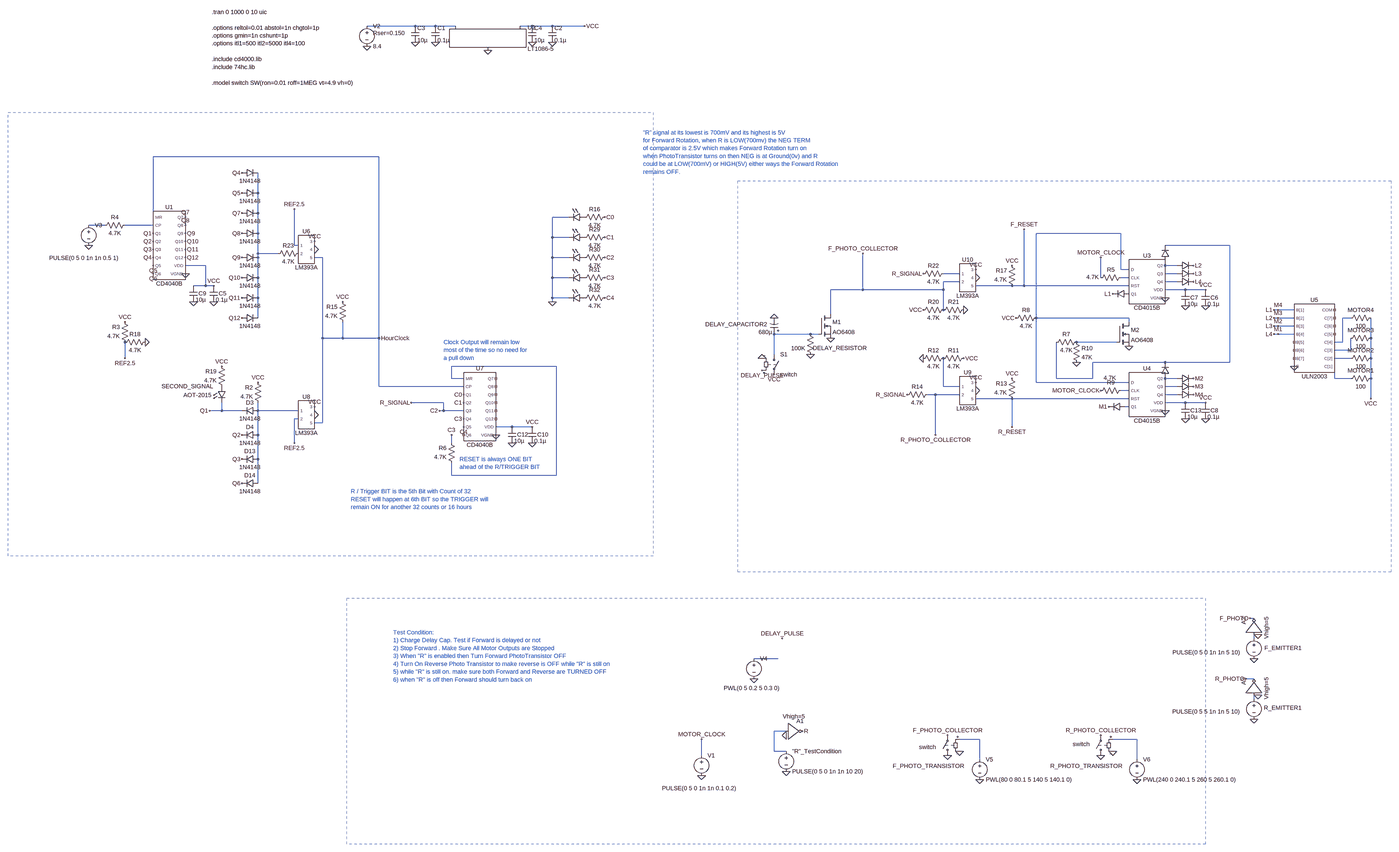
[diagram p0: schematic Draft4_CD4060_LM393.asc, whole sheet]
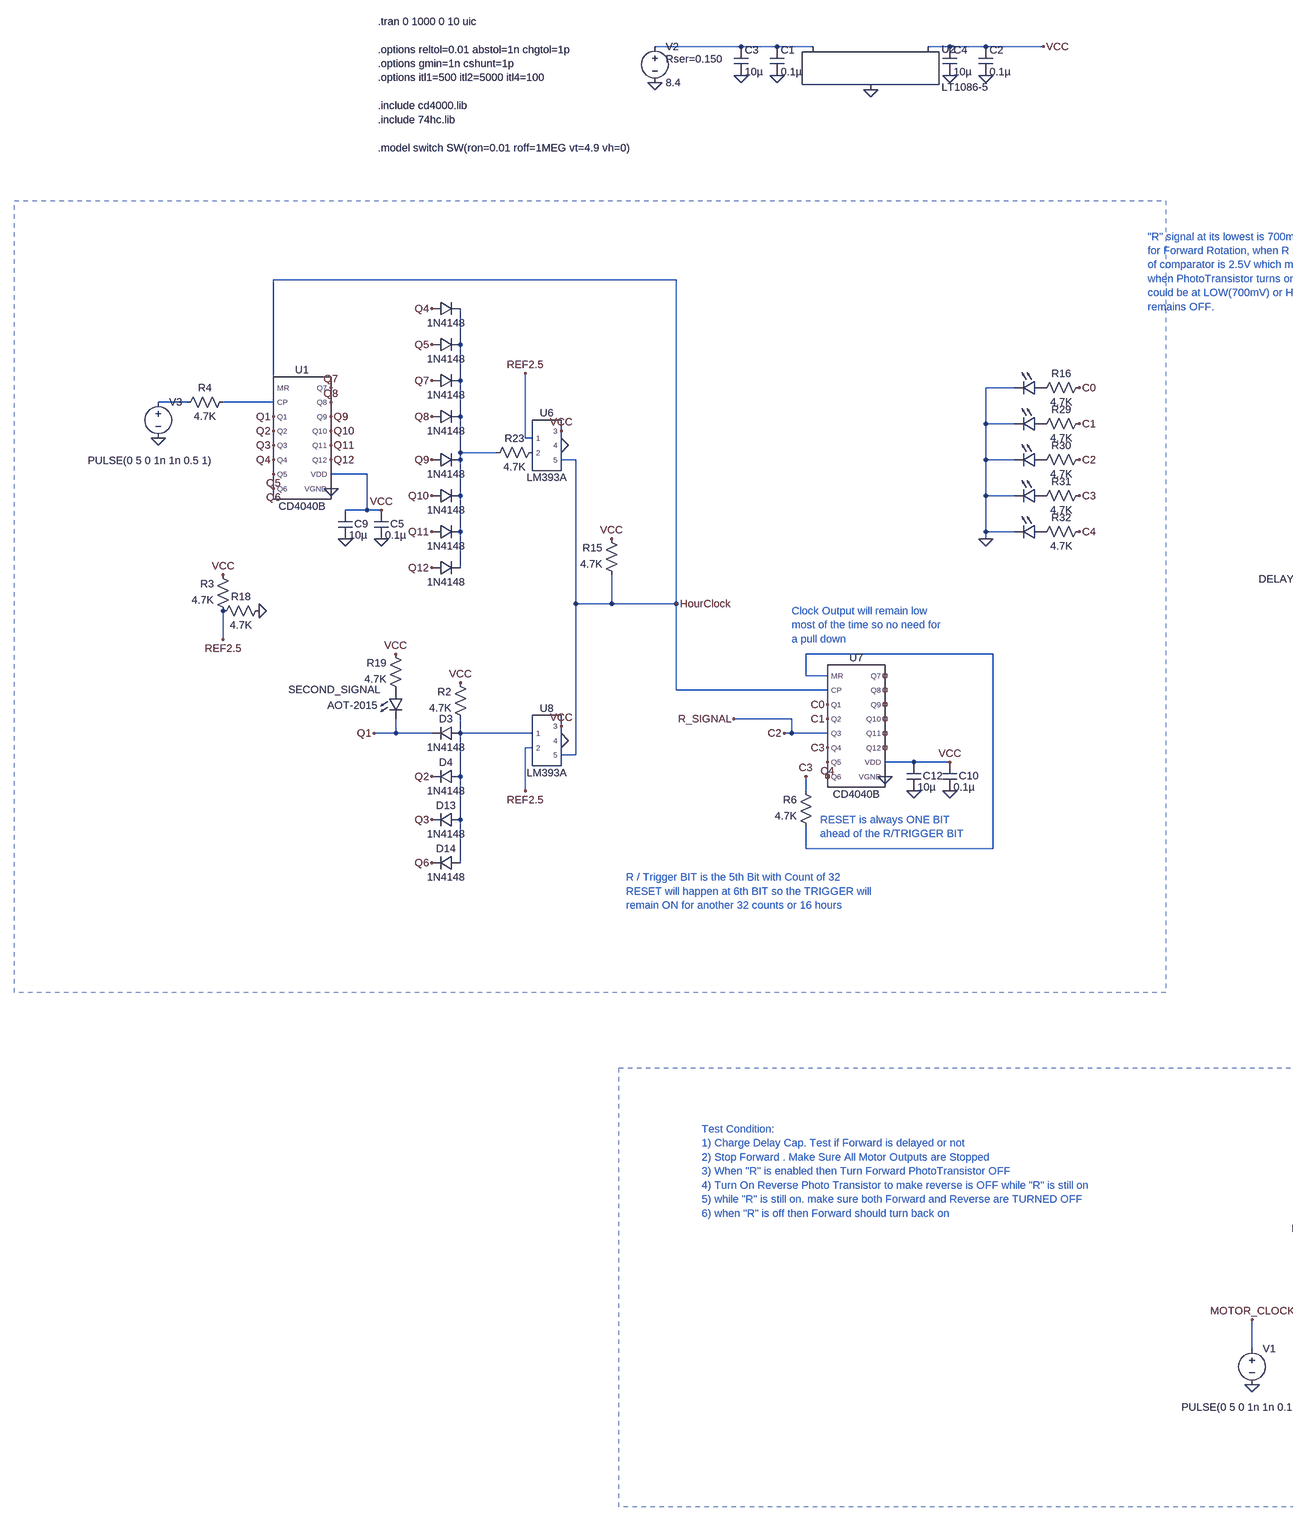
[diagram p1: schematic Draft4_CD4060_LM393.asc, part, row 1 of 1, column 1 of 2]
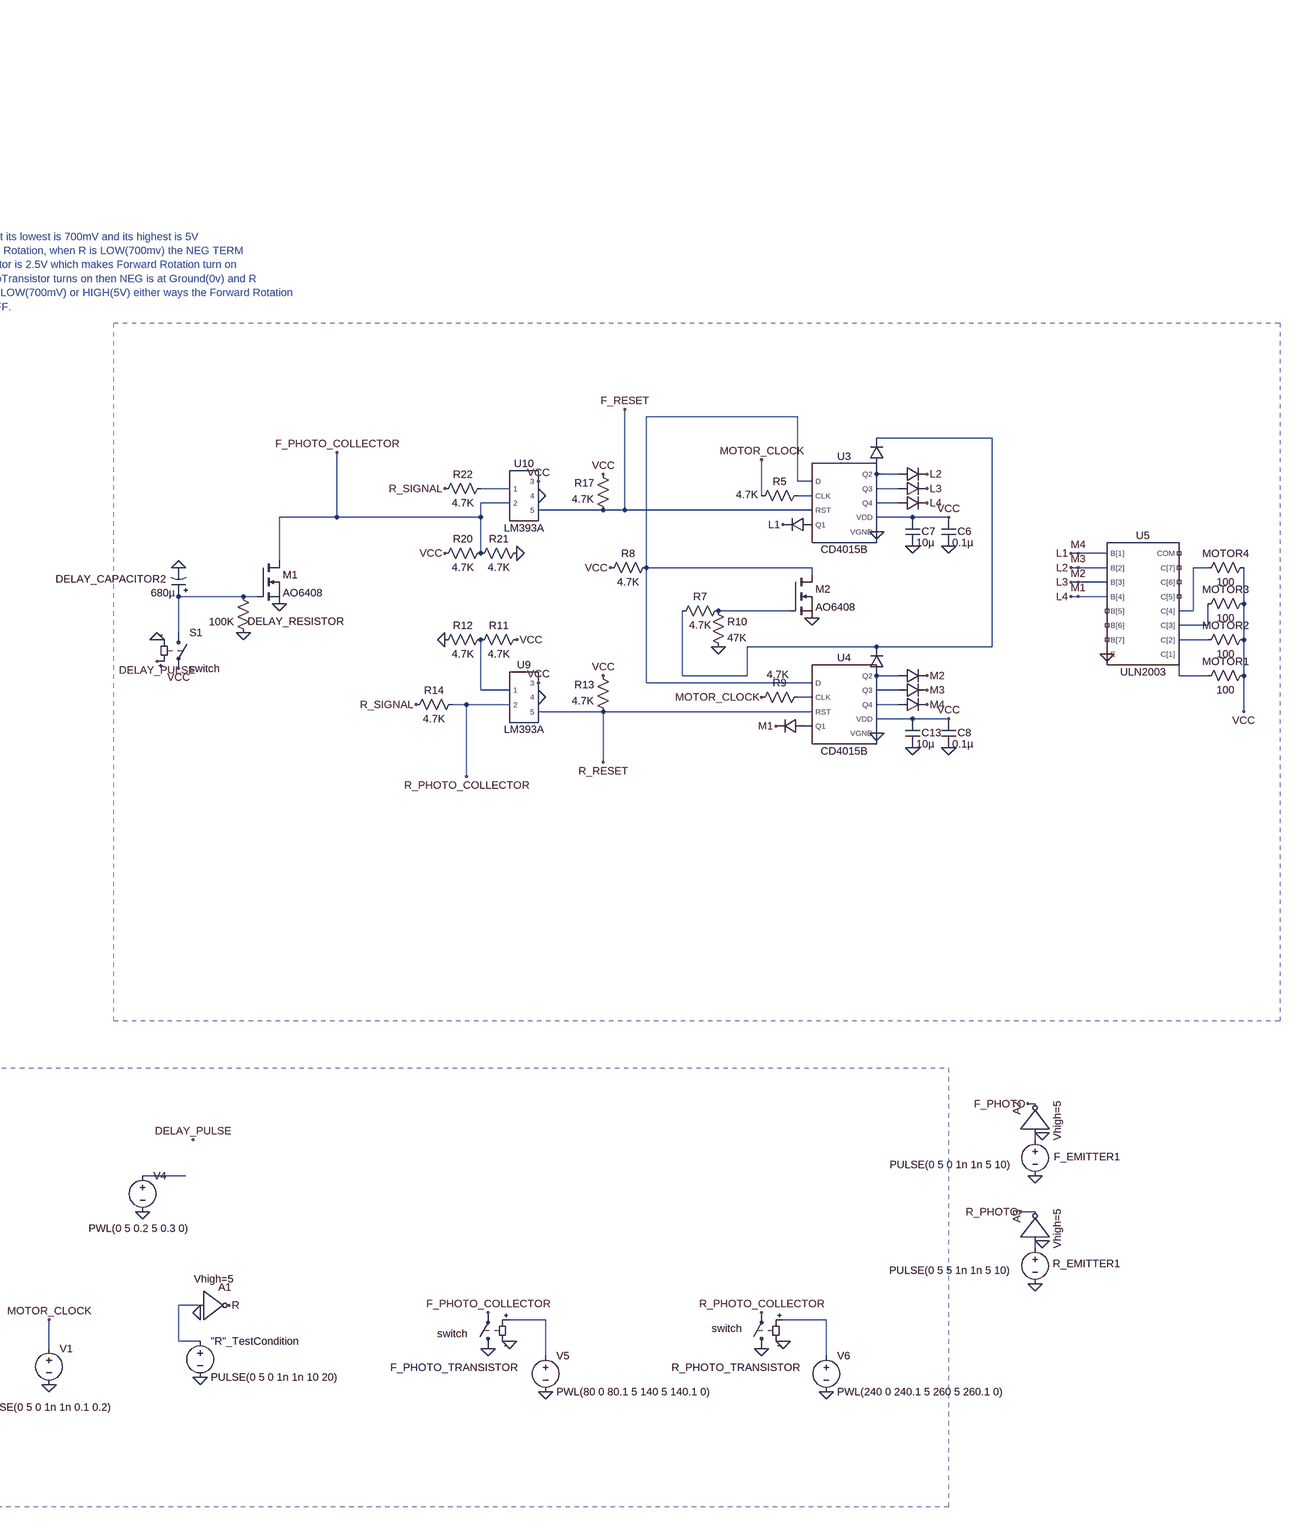
[diagram p2: schematic Draft4_CD4060_LM393.asc, part, row 1 of 1, column 2 of 2]
Draft4_CD4060_LM393.asc, the LTspice schematic file:
Version 4
SHEET 1 3252 2292
WIRE -1248 -1328 -1440 -1328
WIRE -1168 -1328 -1248 -1328
WIRE -1088 -1328 -1168 -1328
WIRE -784 -1328 -832 -1328
WIRE -704 -1328 -784 -1328
WIRE -576 -1328 -704 -1328
WIRE -1392 -448 -2288 -448
WIRE -1872 -304 -1872 -384
WIRE -1872 -224 -1872 -304
WIRE -2288 -208 -2288 -448
WIRE -640 -208 -704 -208
WIRE -2480 -176 -2544 -176
WIRE -2288 -176 -2400 -176
WIRE -1872 -144 -1872 -224
WIRE 1552 -144 1216 -144
WIRE -704 -128 -704 -208
WIRE -640 -128 -704 -128
WIRE -1728 -96 -1728 -240
WIRE -1712 -96 -1728 -96
WIRE 1984 -96 1728 -96
WIRE -1872 -64 -1872 -144
WIRE -1792 -64 -1872 -64
WIRE -1872 -48 -1872 -64
WIRE -1616 -48 -1648 -48
WIRE -704 -48 -704 -128
WIRE -640 -48 -704 -48
WIRE -2080 -16 -2160 -16
WIRE 1728 -16 1728 -32
WIRE 1776 -16 1728 -16
WIRE 1552 0 1552 -144
WIRE 1584 0 1552 0
WIRE 912 16 848 16
WIRE 1776 16 1728 16
WIRE -1872 32 -1872 -48
WIRE -704 32 -704 -48
WIRE -640 32 -704 32
WIRE 1472 32 1472 -48
WIRE 1584 32 1552 32
WIRE 912 48 848 48
WIRE 1776 48 1728 48
WIRE -2080 64 -2080 -16
WIRE -2080 64 -2128 64
WIRE -2048 64 -2080 64
WIRE 1120 64 976 64
WIRE 1168 64 1168 -160
WIRE 1168 64 1120 64
WIRE 1584 64 1168 64
WIRE 528 80 528 -64
WIRE 528 80 400 80
WIRE 848 80 848 48
WIRE 848 80 528 80
WIRE 1808 80 1728 80
WIRE 1888 80 1808 80
WIRE -1872 112 -1872 32
WIRE -704 112 -704 32
WIRE -640 112 -704 112
WIRE -704 128 -704 112
WIRE 848 160 848 80
WIRE 2176 160 2160 160
WIRE 2240 160 2176 160
WIRE 400 176 400 80
WIRE -1872 192 -1872 112
WIRE 1216 192 1216 -144
WIRE 1584 192 1216 192
WIRE 2176 192 2160 192
WIRE 2240 192 2176 192
WIRE 2464 192 2432 192
WIRE 1584 208 1584 192
WIRE 2176 224 2160 224
WIRE 2240 224 2176 224
WIRE 320 256 176 256
WIRE 352 256 320 256
WIRE 2176 256 2160 256
WIRE 2240 256 2176 256
WIRE -1616 272 -1616 -48
WIRE -1536 272 -1536 208
WIRE -1536 272 -1616 272
WIRE -1392 272 -1392 -448
WIRE -1392 272 -1536 272
WIRE 2544 272 2544 192
WIRE 1536 288 1376 288
WIRE 2432 288 2432 192
WIRE 2432 288 2400 288
WIRE 2464 320 2464 272
WIRE 2464 320 2400 320
WIRE 176 336 176 256
WIRE -2400 352 -2400 288
WIRE 2464 352 2400 352
WIRE 2544 352 2544 272
WIRE 1728 368 1440 368
WIRE 1984 368 1984 -96
WIRE 1984 368 1728 368
WIRE -688 384 -1104 384
WIRE -1104 432 -1104 384
WIRE -1056 432 -1104 432
WIRE 1296 432 1296 288
WIRE 1440 432 1440 368
WIRE 1440 432 1296 432
WIRE 1776 432 1728 432
WIRE 2400 432 2400 384
WIRE 2464 432 2400 432
WIRE 2544 432 2544 352
WIRE 1216 448 1216 192
WIRE 1584 448 1216 448
WIRE -1392 464 -1392 272
WIRE -1056 464 -1392 464
WIRE 848 464 848 352
WIRE 912 464 848 464
WIRE 1776 464 1728 464
WIRE 1584 480 1552 480
WIRE 816 496 784 496
WIRE 912 496 816 496
WIRE 1776 496 1728 496
WIRE 1120 512 976 512
WIRE 1584 512 1120 512
WIRE 2544 512 2544 432
WIRE -1136 528 -1264 528
WIRE 1808 528 1728 528
WIRE 1888 528 1808 528
WIRE 1584 544 1568 544
WIRE -2016 560 -2016 528
WIRE -2016 560 -2064 560
WIRE -1936 560 -2016 560
WIRE -1872 560 -1872 528
WIRE -1712 560 -1872 560
WIRE -1136 560 -1136 528
WIRE -1136 560 -1152 560
WIRE -1056 560 -1136 560
WIRE -1712 592 -1728 592
WIRE -1616 608 -1616 272
WIRE -1616 608 -1648 608
WIRE -864 624 -928 624
WIRE -784 624 -864 624
WIRE 1120 624 1120 512
WIRE -1872 656 -1872 560
WIRE 816 656 816 496
WIRE -1728 688 -1728 592
WIRE -1104 688 -1104 656
WIRE -1872 752 -1872 656
WIRE -1104 816 -1104 768
WIRE -688 816 -688 384
WIRE -688 816 -1104 816
WIRE -1872 848 -1872 752
WIRE 2080 1392 2064 1392
WIRE 2080 1472 2080 1456
WIRE 192 1552 96 1552
WIRE 2080 1632 2048 1632
WIRE 2080 1712 2080 1696
WIRE 224 1840 176 1840
WIRE 992 1872 912 1872
WIRE 1616 1872 1520 1872
WIRE 176 1920 176 1840
WIRE 224 1920 176 1920
WIRE -112 1936 -112 1872
WIRE 992 1952 992 1872
WIRE 1616 1952 1616 1872
FLAG -1248 -1264 0
FLAG -1168 -1264 0
FLAG -960 -1232 0
FLAG -784 -1264 0
FLAG -704 -1264 0
FLAG -1440 -1248 0
FLAG -576 -1328 VCC
FLAG -2160 16 0
FLAG -1936 -384 Q4
FLAG -1936 -304 Q5
FLAG -2288 -144 Q1
FLAG -2288 -112 Q2
FLAG -2288 -80 Q3
FLAG -2288 -48 Q4
FLAG -2288 -16 Q5
FLAG -2288 16 Q6
FLAG -2160 -208 Q7
FLAG -2160 -176 Q8
FLAG -2160 -144 Q9
FLAG -2160 -112 Q10
FLAG -2160 -80 Q11
FLAG -2160 -48 Q12
FLAG 864 1936 0
FLAG 2080 1792 0
FLAG 1472 1936 0
FLAG 2080 1552 0
FLAG -2064 560 Q1
FLAG -1936 656 Q2
FLAG -1936 752 Q3
FLAG -1936 848 Q6
FLAG -1936 -224 Q7
FLAG -1936 -144 Q8
FLAG -1936 -48 Q9
FLAG -1936 32 Q10
FLAG -1936 112 Q11
FLAG -1936 192 Q12
FLAG 1520 1920 0
FLAG 912 1920 0
FLAG -2544 -96 0
FLAG -2400 208 VCC
FLAG -1872 448 VCC
FLAG -2048 64 VCC
FLAG -2128 128 0
FLAG -2048 128 0
FLAG -864 688 0
FLAG -784 688 0
FLAG -928 656 0
FLAG -2016 384 VCC
FLAG -1056 496 C0
FLAG -1056 528 C1
FLAG -1056 592 C3
FLAG -1056 624 C4
FLAG -784 624 VCC
FLAG 1808 144 0
FLAG 1888 144 0
FLAG 1888 80 VCC
FLAG 1728 112 0
FLAG 1472 -48 MOTOR_CLOCK
FLAG 1840 -16 L2
FLAG 1520 96 L1
FLAG 1840 48 L4
FLAG 1584 304 0
FLAG 1136 192 VCC
FLAG 1808 592 0
FLAG 1888 592 0
FLAG 1888 528 VCC
FLAG 1728 560 0
FLAG 1472 480 MOTOR_CLOCK
FLAG 1840 432 M2
FLAG 1504 544 M1
FLAG 1840 464 M3
FLAG 1840 496 M4
FLAG 1840 16 L3
FLAG 2240 384 0
FLAG -112 2016 0
FLAG -112 1872 MOTOR_CLOCK
FLAG 2544 512 VCC
FLAG 1376 368 0
FLAG 2160 160 L1
FLAG 2160 192 L2
FLAG 2160 224 L3
FLAG 2160 256 L4
FLAG 2176 160 M4
FLAG 2176 192 M3
FLAG 2176 224 M2
FLAG 2176 256 M1
FLAG 224 2000 0
FLAG 288 1840 R
FLAG 2048 1632 R_PHOTO
FLAG 2064 1392 F_PHOTO
FLAG 224 1856 0
FLAG 2096 1456 0
FLAG 864 1856 F_PHOTO_COLLECTOR
FLAG 1472 1856 R_PHOTO_COLLECTOR
FLAG 2096 1696 0
FLAG -1152 560 C2
FLAG -2320 288 0
FLAG -1648 -112 VCC
FLAG -1648 -80 0
FLAG -1648 544 VCC
FLAG -1648 576 0
FLAG -1536 128 VCC
FLAG -1392 272 HourClock
FLAG -496 -208 C0
FLAG -496 -128 C1
FLAG -496 -48 C2
FLAG -496 32 C3
FLAG -496 112 C4
FLAG -1104 656 C3
FLAG 976 448 VCC
FLAG 976 480 0
FLAG 928 352 VCC
FLAG 768 352 0
FLAG 704 496 R_SIGNAL
FLAG 1120 432 VCC
FLAG 816 656 R_PHOTO_COLLECTOR
FLAG 1120 624 R_RESET
FLAG 1120 -16 VCC
FLAG 976 0 VCC
FLAG 976 32 0
FLAG 768 160 VCC
FLAG 928 160 0
FLAG 768 16 R_SIGNAL
FLAG 528 -64 F_PHOTO_COLLECTOR
FLAG 1168 -160 F_RESET
FLAG 96 1632 0
FLAG 400 272 0
FLAG 176 416 VCC
FLAG 176 192 0
FLAG 128 352 0
FLAG 208 1472 DELAY_PULSE
FLAG 128 400 DELAY_PULSE
FLAG 320 336 0
FLAG -2400 352 REF2.5
FLAG -1728 -240 REF2.5
FLAG -1728 688 REF2.5
FLAG 992 2032 0
FLAG 1616 2032 0
FLAG -1264 528 R_SIGNAL
FLAG -704 128 0
SYMBOL CD4040B -2224 -96 R0
WINDOW 39 0 160 Invisible 2
SYMATTR InstName U1
SYMATTR Value2 vdd=5 speed=1 tripdt=5n
SYMBOL PowerProducts\\LT1086-5 -960 -1328 R0
SYMATTR InstName U2
SYMBOL cap -1184 -1328 R0
SYMATTR InstName C1
SYMATTR Value 0.1µ
SYMATTR SpiceLine V=25 Irms=0 Rser=0.025 Lser=800p mfg="Würth Elektronik" pn="885012206071 WCAP-CSGP 0603" type="X7R"
SYMBOL cap -1264 -1328 R0
SYMATTR InstName C3
SYMATTR Value 10µ
SYMATTR SpiceLine V=25 Irms=0 Rser=0 Lser=0 mfg="Murata" pn="GRM21BR61E106KA73" type="X5R"
SYMBOL cap -720 -1328 R0
SYMATTR InstName C2
SYMATTR Value 0.1µ
SYMATTR SpiceLine V=25 Irms=0 Rser=0.025 Lser=800p mfg="Würth Elektronik" pn="885012206071 WCAP-CSGP 0603" type="X7R"
SYMBOL cap -800 -1328 R0
SYMATTR InstName C4
SYMATTR Value 10µ
SYMATTR SpiceLine V=25 Irms=0 Rser=0 Lser=0 mfg="Murata" pn="GRM21BR61E106KA73" type="X5R"
SYMBOL voltage -1440 -1344 R0
WINDOW 123 0 0 Left 0
WINDOW 39 24 44 Left 2
SYMATTR SpiceLine Rser=0.150
SYMATTR InstName V2
SYMATTR Value 8.4
SYMBOL diode -1936 -368 R270
WINDOW 0 32 32 Invisible 2
WINDOW 3 0 32 VBottom 2
SYMATTR InstName D5
SYMATTR Value 1N4148
SYMBOL diode -1936 -288 R270
WINDOW 0 32 32 Invisible 2
WINDOW 3 0 32 VBottom 2
SYMATTR InstName D6
SYMATTR Value 1N4148
SYMBOL diode -1936 -208 R270
WINDOW 0 32 32 Invisible 2
WINDOW 3 0 32 VBottom 2
SYMATTR InstName D7
SYMATTR Value 1N4148
SYMBOL diode -1936 -128 R270
WINDOW 0 32 32 Invisible 2
WINDOW 3 0 32 VBottom 2
SYMATTR InstName D8
SYMATTR Value 1N4148
SYMBOL diode -1936 -32 R270
WINDOW 0 32 32 Invisible 2
WINDOW 3 0 32 VBottom 2
SYMATTR InstName D9
SYMATTR Value 1N4148
SYMBOL diode -1936 48 R270
WINDOW 0 32 32 Invisible 2
WINDOW 3 0 32 VBottom 2
SYMATTR InstName D10
SYMATTR Value 1N4148
SYMBOL diode -1936 128 R270
WINDOW 0 32 32 Invisible 2
WINDOW 3 0 32 VBottom 2
SYMATTR InstName D11
SYMATTR Value 1N4148
SYMBOL diode -1936 208 R270
WINDOW 0 32 32 Invisible 2
WINDOW 3 0 32 VBottom 2
SYMATTR InstName D12
SYMATTR Value 1N4148
SYMBOL res -2384 -192 R90
WINDOW 0 0 56 VBottom 2
WINDOW 3 32 56 VTop 2
SYMATTR InstName R4
SYMATTR Value 4.7K
SYMBOL ULN2003 2320 272 R0
SYMATTR InstName U5
SYMBOL sw 864 1952 R180
WINDOW 3 46 49 Left 2
WINDOW 0 -65 -26 Left 2
SYMATTR Value switch
SYMATTR InstName F_PHOTO_TRANSISTOR
SYMBOL voltage 2080 1696 R0
WINDOW 0 39 51 Left 2
WINDOW 3 -324 66 Left 2
WINDOW 123 0 0 Left 0
WINDOW 39 0 0 Left 0
SYMATTR InstName R_EMITTER1
SYMATTR Value PULSE(0 5 5 1n 1n 5 10)
SYMBOL sw 1472 1952 R180
WINDOW 3 44 61 Left 2
WINDOW 0 -84 -26 Left 2
SYMATTR Value switch
SYMATTR InstName R_PHOTO_TRANSISTOR
SYMBOL voltage 2080 1456 R0
WINDOW 0 42 54 Left 2
WINDOW 3 -323 71 Left 2
WINDOW 123 0 0 Left 0
WINDOW 39 0 0 Left 0
SYMATTR InstName F_EMITTER1
SYMATTR Value PULSE(0 5 0 1n 1n 5 10)
SYMBOL voltage -2544 -192 R0
WINDOW 3 -157 146 Left 2
WINDOW 123 0 0 Left 0
WINDOW 39 0 0 Left 0
SYMATTR Value PULSE(0 5 0 1n 1n 0.5 1)
SYMATTR InstName V3
SYMBOL res -2384 304 R180
WINDOW 0 36 76 Left 2
WINDOW 3 36 40 Left 2
SYMATTR InstName R3
SYMATTR Value 4.7K
SYMBOL diode -1872 544 R90
WINDOW 0 0 32 VBottom 2
WINDOW 3 32 32 VTop 2
SYMATTR InstName D3
SYMATTR Value 1N4148
SYMBOL diode -1872 640 R90
WINDOW 0 0 32 VBottom 2
WINDOW 3 32 32 VTop 2
SYMATTR InstName D4
SYMATTR Value 1N4148
SYMBOL diode -1872 736 R90
WINDOW 0 0 32 VBottom 2
WINDOW 3 32 32 VTop 2
SYMATTR InstName D13
SYMATTR Value 1N4148
SYMBOL diode -1872 832 R90
WINDOW 0 0 32 VBottom 2
WINDOW 3 32 32 VTop 2
SYMATTR InstName D14
SYMATTR Value 1N4148
SYMBOL res -1856 544 R180
WINDOW 0 36 76 Left 2
WINDOW 3 36 40 Left 2
SYMATTR InstName R2
SYMATTR Value 4.7K
SYMBOL res -1520 224 R180
WINDOW 0 36 76 Left 2
WINDOW 3 36 40 Left 2
SYMATTR InstName R15
SYMATTR Value 4.7K
SYMBOL CD4040B -992 544 R0
WINDOW 39 0 160 Invisible 2
SYMATTR InstName U7
SYMATTR Value2 vdd=5 speed=1 tripdt=5n
SYMBOL cap -2064 64 R0
WINDOW 0 36 31 Left 2
SYMATTR InstName C5
SYMATTR Value 0.1µ
SYMATTR SpiceLine V=25 Irms=0 Rser=0.025 Lser=800p mfg="Würth Elektronik" pn="885012206071 WCAP-CSGP 0603" type="X7R"
SYMBOL cap -2144 64 R0
WINDOW 0 36 31 Left 2
SYMATTR InstName C9
SYMATTR Value 10µ
SYMATTR SpiceLine V=25 Irms=0 Rser=0 Lser=0 mfg="Murata" pn="GRM21BR61E106KA73" type="X5R"
SYMBOL cap -800 624 R0
WINDOW 0 36 31 Left 2
SYMATTR InstName C10
SYMATTR Value 0.1µ
SYMATTR SpiceLine V=25 Irms=0 Rser=0.025 Lser=800p mfg="Würth Elektronik" pn="885012206071 WCAP-CSGP 0603" type="X7R"
SYMBOL cap -880 624 R0
WINDOW 0 36 31 Left 2
SYMATTR InstName C12
SYMATTR Value 10µ
SYMATTR SpiceLine V=25 Irms=0 Rser=0 Lser=0 mfg="Murata" pn="GRM21BR61E106KA73" type="X5R"
SYMBOL res -1088 784 R180
WINDOW 0 36 76 Left 2
WINDOW 3 36 40 Left 2
SYMATTR InstName R6
SYMATTR Value 4.7K
SYMBOL res -2000 480 R180
WINDOW 0 36 76 Left 2
WINDOW 3 36 40 Left 2
SYMATTR InstName R19
SYMATTR Value 4.7K
SYMBOL LED -2032 464 R0
WINDOW 0 -223 -1 Left 2
WINDOW 3 -136 34 Left 2
SYMATTR InstName SECOND_SIGNAL
SYMATTR Value AOT-2015
SYMBOL CD4015B 1648 48 R0
WINDOW 39 8 112 Invisible 2
SYMATTR InstName U3
SYMATTR Value2 vdd=5 speed=1 tripdt=5n
SYMBOL cap 1872 80 R0
WINDOW 0 36 31 Left 2
SYMATTR InstName C6
SYMATTR Value 0.1µ
SYMATTR SpiceLine V=25 Irms=0 Rser=0.025 Lser=800p mfg="Würth Elektronik" pn="885012206071 WCAP-CSGP 0603" type="X7R"
SYMBOL cap 1792 80 R0
WINDOW 0 36 31 Left 2
SYMATTR InstName C7
SYMATTR Value 10µ
SYMATTR SpiceLine V=25 Irms=0 Rser=0 Lser=0 mfg="Murata" pn="GRM21BR61E106KA73" type="X5R"
SYMBOL res 1568 16 R90
WINDOW 0 0 56 VBottom 2
WINDOW 3 -2 128 VTop 2
SYMATTR InstName R5
SYMATTR Value 4.7K
SYMBOL nmos 1536 208 R0
SYMATTR InstName M2
SYMATTR Value AO6408
SYMBOL res 1392 272 R90
WINDOW 0 0 56 VBottom 2
WINDOW 3 32 56 VTop 2
SYMATTR InstName R7
SYMATTR Value 4.7K
SYMBOL res 1232 176 R90
WINDOW 0 0 56 VBottom 2
WINDOW 3 32 56 VTop 2
SYMATTR InstName R8
SYMATTR Value 4.7K
SYMBOL CD4015B 1648 496 R0
WINDOW 39 8 112 Invisible 2
SYMATTR InstName U4
SYMATTR Value2 vdd=5 speed=1 tripdt=5n
SYMBOL cap 1872 528 R0
WINDOW 0 36 31 Left 2
SYMATTR InstName C8
SYMATTR Value 0.1µ
SYMATTR SpiceLine V=25 Irms=0 Rser=0.025 Lser=800p mfg="Würth Elektronik" pn="885012206071 WCAP-CSGP 0603" type="X7R"
SYMBOL cap 1792 528 R0
WINDOW 0 36 31 Left 2
SYMATTR InstName C13
SYMATTR Value 10µ
SYMATTR SpiceLine V=25 Irms=0 Rser=0 Lser=0 mfg="Murata" pn="GRM21BR61E106KA73" type="X5R"
SYMBOL res 1568 464 R90
WINDOW 0 0 56 VBottom 2
WINDOW 3 -50 60 VTop 2
SYMATTR InstName R9
SYMATTR Value 4.7K
SYMBOL diode 1584 80 R90
WINDOW 0 0 32 Invisible 2
WINDOW 3 32 32 Invisible 2
SYMATTR InstName D20
SYMATTR Value 1N4148
SYMBOL diode 1776 0 R270
WINDOW 0 32 32 Invisible 2
WINDOW 3 0 32 Invisible 2
SYMATTR InstName D21
SYMATTR Value 1N4148
SYMBOL diode 1776 32 R270
WINDOW 0 32 32 Invisible 2
WINDOW 3 0 32 Invisible 2
SYMATTR InstName D22
SYMATTR Value 1N4148
SYMBOL diode 1776 64 R270
WINDOW 0 32 32 Invisible 2
WINDOW 3 0 32 Invisible 2
SYMATTR InstName D23
SYMATTR Value 1N4148
SYMBOL diode 1776 448 R270
WINDOW 0 32 32 Invisible 2
WINDOW 3 0 32 Invisible 2
SYMATTR InstName D24
SYMATTR Value 1N4148
SYMBOL diode 1776 480 R270
WINDOW 0 32 32 Invisible 2
WINDOW 3 0 32 Invisible 2
SYMATTR InstName D25
SYMATTR Value 1N4148
SYMBOL diode 1776 512 R270
WINDOW 0 32 32 Invisible 2
WINDOW 3 0 32 Invisible 2
SYMATTR InstName D26
SYMATTR Value 1N4148
SYMBOL diode 1568 528 R90
WINDOW 0 0 32 Invisible 2
WINDOW 3 32 32 Invisible 2
SYMATTR InstName D27
SYMATTR Value 1N4148
SYMBOL voltage -112 1920 R0
WINDOW 3 -157 146 Left 2
WINDOW 123 0 0 Left 0
WINDOW 39 0 0 Left 0
SYMATTR Value PULSE(0 5 0 1n 1n 0.1 0.2)
SYMATTR InstName V1
SYMBOL res 2560 416 R90
WINDOW 0 0 56 VBottom 2
WINDOW 3 32 56 VTop 2
SYMATTR InstName MOTOR1
SYMATTR Value 100
SYMBOL res 2560 336 R90
WINDOW 0 0 56 VBottom 2
WINDOW 3 32 56 VTop 2
SYMATTR InstName MOTOR2
SYMATTR Value 100
SYMBOL res 2560 256 R90
WINDOW 0 0 56 VBottom 2
WINDOW 3 32 56 VTop 2
SYMATTR InstName MOTOR3
SYMATTR Value 100
SYMBOL res 2560 176 R90
WINDOW 0 0 56 VBottom 2
WINDOW 3 32 56 VTop 2
SYMATTR InstName MOTOR4
SYMATTR Value 100
SYMBOL diode 1744 -32 R180
WINDOW 0 24 64 Invisible 2
WINDOW 3 24 0 Invisible 2
SYMATTR InstName D2
SYMATTR Value 1N4148
SYMBOL diode 1744 432 R180
WINDOW 0 24 64 Invisible 2
WINDOW 3 24 0 Invisible 2
SYMATTR InstName D16
SYMATTR Value 1N4148
SYMBOL res 1360 272 R0
SYMATTR InstName R10
SYMATTR Value 47K
SYMBOL voltage 224 1904 R0
WINDOW 123 0 0 Left 0
WINDOW 39 0 0 Left 0
SYMATTR InstName "R"_TestCondition
SYMATTR Value PULSE(0 5 0 1n 1n 10 20)
SYMBOL Digital\\inv 224 1776 R0
WINDOW 3 -14 5 Left 2
SYMATTR Value Vhigh=5
SYMATTR InstName A1
SYMBOL Digital\\inv 2016 1456 R270
WINDOW 3 -18 114 Left 2
SYMATTR Value Vhigh=5
SYMATTR InstName A2
SYMBOL Digital\\inv 2016 1696 R270
WINDOW 3 -18 114 Left 2
SYMATTR Value Vhigh=5
SYMATTR InstName A3
SYMBOL LM393A -1680 -80 R0
SYMATTR InstName U6
SYMBOL res -2416 304 R270
WINDOW 0 32 56 VTop 2
WINDOW 3 0 56 VBottom 2
SYMATTR InstName R18
SYMATTR Value 4.7K
SYMBOL LM393A -1680 576 R0
SYMATTR InstName U8
SYMBOL LED -576 -224 R90
WINDOW 0 0 32 Invisible 2
WINDOW 3 72 32 Invisible 2
SYMATTR InstName D35
SYMATTR Value NSPW500BS
SYMATTR Description Diode
SYMATTR Type diode
SYMBOL LED -576 -144 R90
WINDOW 0 0 32 Invisible 2
WINDOW 3 72 32 Invisible 2
SYMATTR InstName D36
SYMATTR Value NSPW500BS
SYMATTR Description Diode
SYMATTR Type diode
SYMBOL LED -576 -64 R90
WINDOW 0 0 32 Invisible 2
WINDOW 3 72 32 Invisible 2
SYMATTR InstName D37
SYMATTR Value NSPW500BS
SYMATTR Description Diode
SYMATTR Type diode
SYMBOL LED -576 16 R90
WINDOW 0 0 32 Invisible 2
WINDOW 3 72 32 Invisible 2
SYMATTR InstName D38
SYMATTR Value NSPW500BS
SYMATTR Description Diode
SYMATTR Type diode
SYMBOL LED -576 96 R90
WINDOW 0 0 32 Invisible 2
WINDOW 3 72 32 Invisible 2
SYMATTR InstName D39
SYMATTR Value NSPW500BS
SYMATTR Description Diode
SYMATTR Type diode
SYMBOL res -480 -224 R90
WINDOW 0 0 56 VBottom 2
WINDOW 3 32 56 VTop 2
SYMATTR InstName R16
SYMATTR Value 4.7K
SYMBOL res -480 -144 R90
WINDOW 0 0 56 VBottom 2
WINDOW 3 32 56 VTop 2
SYMATTR InstName R29
SYMATTR Value 4.7K
SYMBOL res -480 -64 R90
WINDOW 0 0 56 VBottom 2
WINDOW 3 32 56 VTop 2
SYMATTR InstName R30
SYMATTR Value 4.7K
SYMBOL res -480 16 R90
WINDOW 0 0 56 VBottom 2
WINDOW 3 32 56 VTop 2
SYMATTR InstName R31
SYMATTR Value 4.7K
SYMBOL res -480 96 R90
WINDOW 0 0 56 VBottom 2
WINDOW 3 32 56 VTop 2
SYMATTR InstName R32
SYMATTR Value 4.7K
SYMBOL LM393A 944 480 R0
SYMATTR InstName U9
SYMBOL res 944 336 R90
WINDOW 0 0 56 VBottom 2
WINDOW 3 32 56 VTop 2
SYMATTR InstName R11
SYMATTR Value 4.7K
SYMBOL res 864 336 R90
WINDOW 0 0 56 VBottom 2
WINDOW 3 32 56 VTop 2
SYMATTR InstName R12
SYMATTR Value 4.7K
SYMBOL res 1136 528 R180
WINDOW 0 36 76 Left 2
WINDOW 3 36 40 Left 2
SYMATTR InstName R13
SYMATTR Value 4.7K
SYMBOL res 688 512 R270
WINDOW 0 32 56 VTop 2
WINDOW 3 0 56 VBottom 2
SYMATTR InstName R14
SYMATTR Value 4.7K
SYMBOL res 1136 80 R180
WINDOW 0 36 76 Left 2
WINDOW 3 36 40 Left 2
SYMATTR InstName R17
SYMATTR Value 4.7K
SYMBOL LM393A 944 32 R0
SYMATTR InstName U10
SYMBOL res 752 176 R270
WINDOW 0 32 56 VTop 2
WINDOW 3 0 56 VBottom 2
SYMATTR InstName R20
SYMATTR Value 4.7K
SYMBOL res 832 176 R270
WINDOW 0 32 56 VTop 2
WINDOW 3 0 56 VBottom 2
SYMATTR InstName R21
SYMATTR Value 4.7K
SYMBOL res 752 32 R270
WINDOW 0 32 56 VTop 2
WINDOW 3 0 56 VBottom 2
SYMATTR InstName R22
SYMATTR Value 4.7K
SYMBOL voltage 96 1536 R0
WINDOW 3 -120 133 Left 2
WINDOW 123 0 0 Left 0
WINDOW 39 0 0 Left 0
SYMATTR InstName V4
SYMATTR Value PWL(0 5 0.2 5 0.3 0)
SYMBOL nmos 352 176 R0
SYMATTR InstName M1
SYMATTR Value AO6408
SYMBOL polcap 192 256 R180
WINDOW 0 45 39 Left 2
WINDOW 3 24 8 Left 2
SYMATTR InstName DELAY_CAPACITOR2
SYMATTR Value 680µ
SYMATTR Description Capacitor
SYMATTR Type cap
SYMATTR SpiceLine V=25 Irms=792m Rser=0.093 Lser=4n mfg="Würth Elektronik" pn="860010475015 WCAP-ATG8 10x16" type="Al electrolytic"
SYMBOL res 336 352 R180
WINDOW 0 -207 41 Left 2
WINDOW 3 36 40 Left 2
SYMATTR InstName DELAY_RESISTOR
SYMATTR Value 100K
SYMBOL sw 176 320 R0
SYMATTR InstName S1
SYMATTR Value switch
SYMBOL res -1696 -80 R90
WINDOW 0 0 56 VBottom 2
WINDOW 3 32 56 VTop 2
SYMATTR InstName R23
SYMATTR Value 4.7K
SYMBOL voltage 992 1936 R0
WINDOW 123 0 0 Left 0
WINDOW 39 0 0 Left 0
SYMATTR InstName V5
SYMATTR Value PWL(80 0 80.1 5 140 5 140.1 0)
SYMBOL voltage 1616 1936 R0
WINDOW 123 0 0 Left 0
WINDOW 39 0 0 Left 0
SYMATTR InstName V6
SYMATTR Value PWL(240 0 240.1 5 260 5 260.1 0)
TEXT -2056 -1384 Left 2 !.tran 0 1000 0 10 uic\n \n.options reltol=0.01 abstol=1n chgtol=1p\n.options gmin=1n cshunt=1p\n.options itl1=500 itl2=5000 itl4=100\n \n.include cd4000.lib\n.include 74hc.lib\n \n.model switch SW(ron=0.01 roff=1MEG vt=4.9 vh=0)
TEXT -1504 880 Left 2 ;R / Trigger BIT is the 5th Bit with Count of 32 \nRESET will happen at 6th BIT so the TRIGGER will \nremain ON for another 32 counts or 16 hours
TEXT -1072 752 Left 2 ;RESET is always ONE BIT \nahead of the R/TRIGGER BIT
TEXT -1336 1448 Left 2 ;Test Condition:\n1) Charge Delay Cap. Test if Forward is delayed or not\n2) Stop Forward . Make Sure All Motor Outputs are Stopped\n3) When "R" is enabled then Turn Forward PhotoTransistor OFF\n4) Turn On Reverse Photo Transistor to make reverse is OFF while "R" is still on \n5) while "R" is still on. make sure both Forward and Reverse are TURNED OFF\n6) when "R" is off then Forward should turn back on
TEXT -1136 288 Left 2 ;Clock Output will remain low \nmost of the time so no need for \na pull down
TEXT -344 -544 Left 2 ;"R" signal at its lowest is 700mV and its highest is 5V\nfor Forward Rotation, when R is LOW(700mv) the NEG TERM \nof comparator is 2.5V which makes Forward Rotation turn on \nwhen PhotoTransistor turns on then NEG is at Ground(0v) and R\ncould be at LOW(700mV) or HIGH(5V) either ways the Forward Rotation\nremains OFF.
RECTANGLE Normal -304 1136 -2864 -624 2
RECTANGLE Normal 2624 1200 32 -352 2
RECTANGLE Normal 1888 2288 -1520 1312 2

The netlist it stands for:
* Draft4_CD4060_LM393.asc
XU1 HourClock N004 Q1 Q2 Q3 Q4 Q5 Q6 Q7 Q8 Q9 Q10 Q11 Q12 VCC 0 CD4040B vdd=5 speed=1 tripdt=5n vdd1={vdd} speed1={speed} tripdt1={tripdt}  ; pins MR CP Q1 Q2 Q3 Q4 Q5 Q6 Q7 Q8 Q9 Q10 Q11 Q12 VDD VGND
XU2 0 VCC N001 LT1086-5
C1 N001 0 0.1µ V=25 Irms=0 Rser=0.025 Lser=800p mfg="Würth Elektronik" pn="885012206071 WCAP-CSGP 0603" type="X7R"
C3 N001 0 10µ V=25 Irms=0 Rser=0 Lser=0 mfg="Murata" pn="GRM21BR61E106KA73" type="X5R"
C2 VCC 0 0.1µ V=25 Irms=0 Rser=0.025 Lser=800p mfg="Würth Elektronik" pn="885012206071 WCAP-CSGP 0603" type="X7R"
C4 VCC 0 10µ V=25 Irms=0 Rser=0 Lser=0 mfg="Murata" pn="GRM21BR61E106KA73" type="X5R"
V2 N001 0 8.4 Rser=0.150
D5 Q4 N002 1N4148
D6 Q5 N002 1N4148
D7 Q7 N002 1N4148
D8 Q8 N002 1N4148
D9 Q9 N002 1N4148
D10 Q10 N002 1N4148
D11 Q11 N002 1N4148
D12 Q12 N002 1N4148
R4 N004 N003 4.7K
XU5 M4 M3 L3 M1 NC_01 NC_02 NC_03 0 NC_04 NC_05 NC_06 NC_07 N012 N015 N016 N019 ULN2003  ; pins B[1] B[2] B[3] B[4] B[5] B[6] B[7] E COM C[7] C[6] C[5] C[4] C[3] C[2] C[1]
S§F_PHOTO_TRANSISTOR 0 F_PHOTO_COLLECTOR N030 0 switch
V§R_EMITTER1 N028 0 PULSE(0 5 5 1n 1n 5 10)
S§R_PHOTO_TRANSISTOR 0 R_PHOTO_COLLECTOR N031 0 switch
V§F_EMITTER1 N026 0 PULSE(0 5 0 1n 1n 5 10)
V3 N003 0 PULSE(0 5 0 1n 1n 0.5 1)
R3 REF2.5 VCC 4.7K
D3 N025 Q1 1N4148
D4 N025 Q2 1N4148
D13 N025 Q3 1N4148
D14 N025 Q6 1N4148
R2 N025 VCC 4.7K
R15 HourClock VCC 4.7K
XU7 N017 HourClock C0 C1 R_SIGNAL C3 C4 NC_08 NC_09 NC_10 NC_11 NC_12 NC_13 NC_14 VCC 0 CD4040B vdd=5 speed=1 tripdt=5n vdd1={vdd} speed1={speed} tripdt1={tripdt}  ; pins MR CP Q1 Q2 Q3 Q4 Q5 Q6 Q7 Q8 Q9 Q10 Q11 Q12 VDD VGND
C5 VCC 0 0.1µ V=25 Irms=0 Rser=0.025 Lser=800p mfg="Würth Elektronik" pn="885012206071 WCAP-CSGP 0603" type="X7R"
C9 VCC 0 10µ V=25 Irms=0 Rser=0 Lser=0 mfg="Murata" pn="GRM21BR61E106KA73" type="X5R"
C10 VCC 0 0.1µ V=25 Irms=0 Rser=0.025 Lser=800p mfg="Würth Elektronik" pn="885012206071 WCAP-CSGP 0603" type="X7R"
C12 VCC 0 10µ V=25 Irms=0 Rser=0 Lser=0 mfg="Murata" pn="GRM21BR61E106KA73" type="X5R"
R6 N017 C3 4.7K
R19 P001 VCC 4.7K
D§SECOND_SIGNAL P001 Q1 AOT-2015
XU3 N005 N010 F_RESET P002 N007 N009 N011 VCC 0 CD4015B vdd=5 speed=1 tripdt=5n vdd1={vdd} speed1={speed} tripdt1={tripdt}  ; pins D CLK RST Q1 Q2 Q3 Q4 VDD VGND
C6 VCC 0 0.1µ V=25 Irms=0 Rser=0.025 Lser=800p mfg="Würth Elektronik" pn="885012206071 WCAP-CSGP 0603" type="X7R"
C7 VCC 0 10µ V=25 Irms=0 Rser=0 Lser=0 mfg="Murata" pn="GRM21BR61E106KA73" type="X5R"
R5 N010 MOTOR_CLOCK 4.7K
M2 N005 N014 0 0 AO6408
R7 N014 N006 4.7K
R8 N005 VCC 4.7K
XU4 N005 N022 R_RESET N024 N018 N021 N023 VCC 0 CD4015B vdd=5 speed=1 tripdt=5n vdd1={vdd} speed1={speed} tripdt1={tripdt}  ; pins D CLK RST Q1 Q2 Q3 Q4 VDD VGND
C8 VCC 0 0.1µ V=25 Irms=0 Rser=0.025 Lser=800p mfg="Würth Elektronik" pn="885012206071 WCAP-CSGP 0603" type="X7R"
C13 VCC 0 10µ V=25 Irms=0 Rser=0 Lser=0 mfg="Murata" pn="GRM21BR61E106KA73" type="X5R"
R9 N022 MOTOR_CLOCK 4.7K
D20 P002 M4 1N4148
D21 N007 M3 1N4148
D22 N009 L3 1N4148
D23 N011 M1 1N4148
D24 N018 L3 1N4148
D25 N021 M3 1N4148
D26 N023 M4 1N4148
D27 N024 M1 1N4148
V1 MOTOR_CLOCK 0 PULSE(0 5 0 1n 1n 0.1 0.2)
R§MOTOR1 VCC N019 100
R§MOTOR2 VCC N016 100
R§MOTOR3 VCC N015 100
R§MOTOR4 VCC N012 100
D2 N007 N006 1N4148
D16 N018 N006 1N4148
R10 N014 0 47K
V§"R"_TestCondition N029 0 PULSE(0 5 0 1n 1n 10 20)
A1 N029 0 0 0 0 R 0 0 BUF Vhigh=5
A2 N026 0 0 0 0 F_PHOTO 0 0 BUF Vhigh=5
A3 N028 0 0 0 0 R_PHOTO 0 0 BUF Vhigh=5
XU6 REF2.5 P003 VCC 0 HourClock LM393A  ; pins 1 2 3 4 5
R18 REF2.5 0 4.7K
XU8 N025 REF2.5 VCC 0 HourClock LM393A  ; pins 1 2 3 4 5
D35 P004 0 NSPW500BS
D36 P005 0 NSPW500BS
D37 P006 0 NSPW500BS
D38 P007 0 NSPW500BS
D39 P008 0 NSPW500BS
R16 C0 P004 4.7K
R29 C1 P005 4.7K
R30 R_SIGNAL P006 4.7K
R31 C3 P007 4.7K
R32 C4 P008 4.7K
XU9 N020 R_PHOTO_COLLECTOR VCC 0 R_RESET LM393A  ; pins 1 2 3 4 5
R11 VCC N020 4.7K
R12 N020 0 4.7K
R13 R_RESET VCC 4.7K
R14 R_SIGNAL R_PHOTO_COLLECTOR 4.7K
R17 F_RESET VCC 4.7K
XU10 N008 F_PHOTO_COLLECTOR VCC 0 F_RESET LM393A  ; pins 1 2 3 4 5
R20 VCC F_PHOTO_COLLECTOR 4.7K
R21 F_PHOTO_COLLECTOR 0 4.7K
R22 R_SIGNAL N008 4.7K
V4 N027 0 PWL(0 5 0.2 5 0.3 0)
M1 F_PHOTO_COLLECTOR N013 0 0 AO6408
C§DELAY_CAPACITOR2 N013 0 680µ V=25 Irms=792m Rser=0.093 Lser=4n mfg="Würth Elektronik" pn="860010475015 WCAP-ATG8 10x16" type="Al electrolytic"
R§DELAY_RESISTOR 0 N013 100K
S1 N013 VCC DELAY_PULSE 0 switch
R23 P003 N002 4.7K
V5 N030 0 PWL(80 0 80.1 5 140 5 140.1 0)
V6 N031 0 PWL(240 0 240.1 5 260 5 260.1 0)
.model D D
.lib standard.dio
.model NMOS NMOS
.model PMOS PMOS
.lib standard.mos
.tran 0 1000 0 10 uic
.options reltol=0.01 abstol=1n chgtol=1p
.options gmin=1n cshunt=1p
.options itl1=500 itl2=5000 itl4=100
.include cd4000.lib
.include 74hc.lib
.model switch SW(ron=0.01 roff=1MEG vt=4.9 vh=0)
* R / Trigger BIT is the 5th Bit with Count of 32
* RESET will happen at 6th BIT so the TRIGGER will
* remain ON for another 32 counts or 16 hours
* RESET is always ONE BIT
* ahead of the R/TRIGGER BIT
* Test Condition:
* 1) Charge Delay Cap. Test if Forward is delayed or not
* 2) Stop Forward . Make Sure All Motor Outputs are Stopped
* 3) When "R" is enabled then Turn Forward PhotoTransistor OFF
* 4) Turn On Reverse Photo Transistor to make reverse is OFF while "R" is still on
* 5) while "R" is still on. make sure both Forward and Reverse are TURNED OFF
* 6) when "R" is off then Forward should turn back on
* Clock Output will remain low
* most of the time so no need for
* a pull down
* "R" signal at its lowest is 700mV and its highest is 5V
* for Forward Rotation, when R is LOW(700mv) the NEG TERM
* of comparator is 2.5V which makes Forward Rotation turn on
* when PhotoTransistor turns on then NEG is at Ground(0v) and R
* could be at LOW(700mV) or HIGH(5V) either ways the Forward Rotation
* remains OFF.
.lib CD4000.lib
.lib C:\Users\Parmeet Singh Ghai\Documents\GitHub\AutomatedLockSystem\LTSpice\ULN2003.lib
.lib C:\Users\Parmeet Singh Ghai\Documents\GitHub\AutomatedLockSystem\LTSpice\CD4015B.sub
.lib C:\Users\Parmeet Singh Ghai\Documents\GitHub\AutomatedLockSystem\LTSpice\LM393A.sub
.backanno
.end